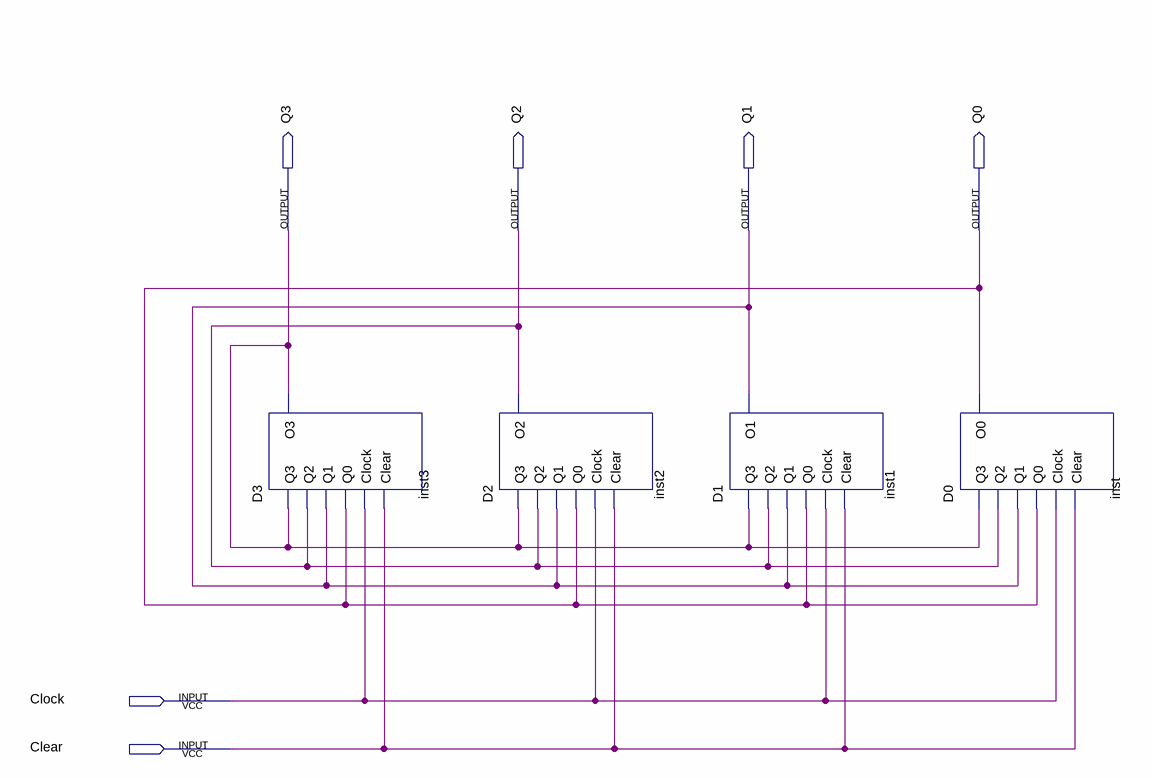
[diagram p0: schematic sheet]
// Quartus schematic ContadorFF.bdf as structural Verilog: 4 symbols, 6 pins
module ContadorFF (
  input  Clock,
  input  Clear,
  output Q3,
  output Q2,
  output Q1,
  output Q0
);

  D3 inst3 (.Q3(Q3), .Q2(Q2), .Q1(Q1), .Q0(Q0), .Clock(Clock), .Clear(Clear), .O3(Q3));
  D2 inst2 (.Q3(Q3), .Q2(Q2), .Q1(Q1), .Q0(Q0), .Clock(Clock), .Clear(Clear), .O2(Q2));
  D1 inst1 (.Q3(Q3), .Q2(Q2), .Q1(Q1), .Q0(Q0), .Clock(Clock), .Clear(Clear), .O1(Q1));
  D0 inst (.Q3(Q3), .Q2(Q2), .Q1(Q1), .Q0(Q0), .Clock(Clock), .Clear(Clear), .O0(Q0));
endmodule
